# Altium project MUHTAS-1.PrjPcb
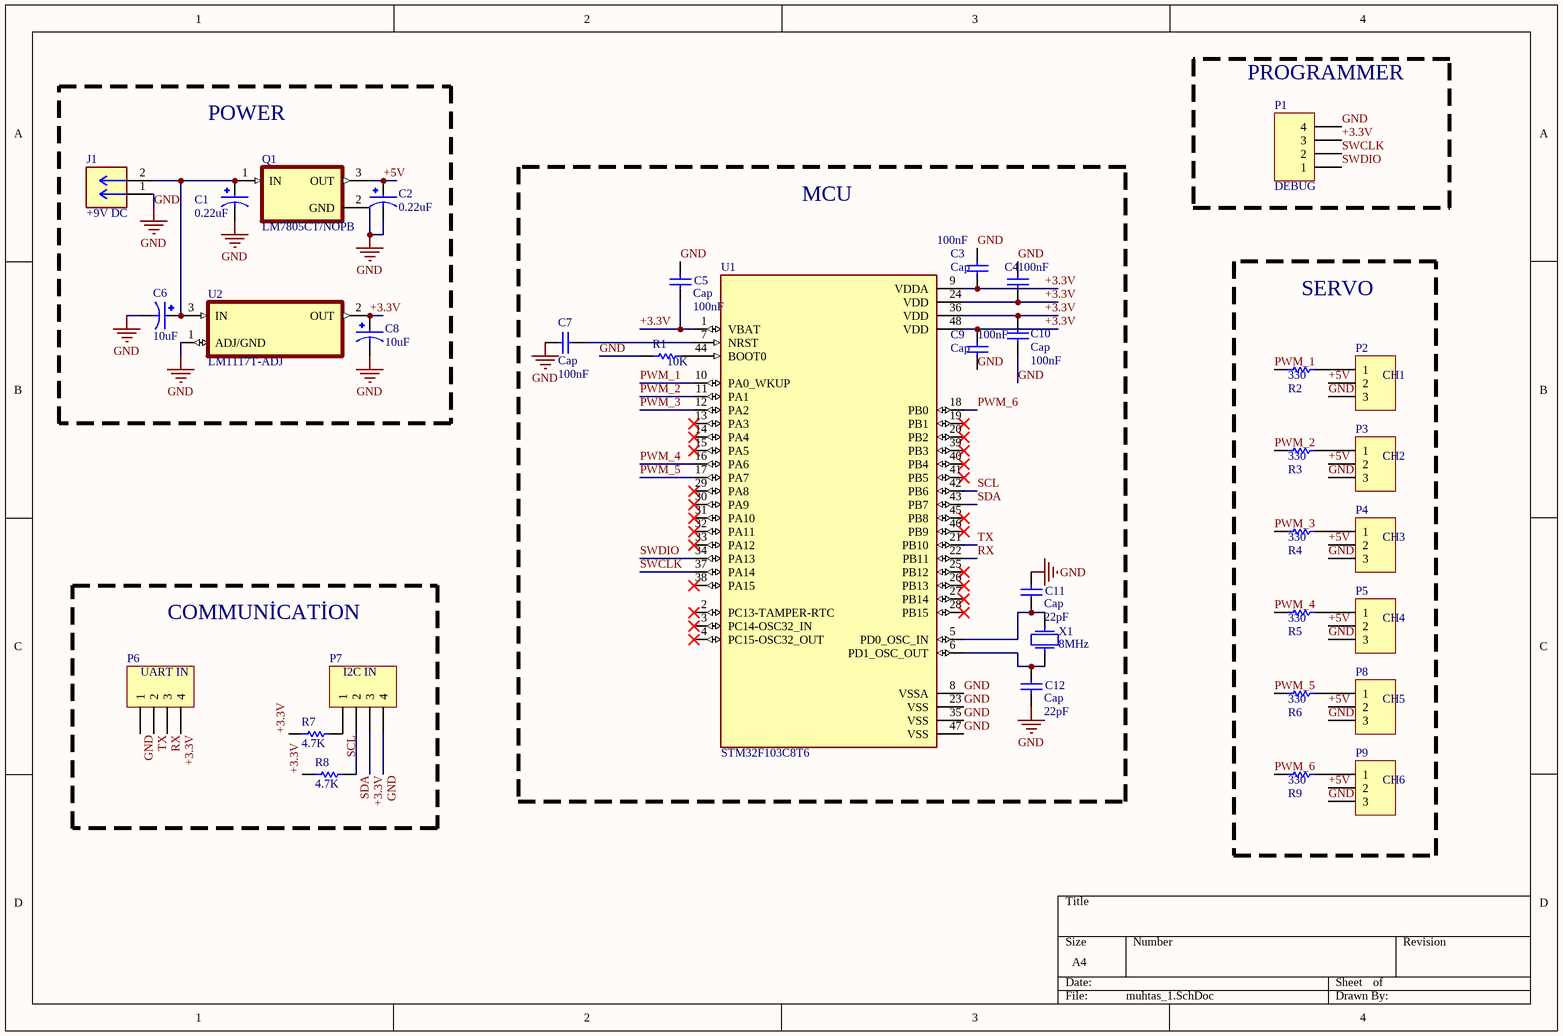
[diagram p0: muhtas_1.SchDoc]
2 sheets, 71 parts. Net scope: global (net labels, ports and power ports of the same name join across sheets).
Board files: MUHTAS-1.PcbDoc, baski.PcbDoc
Sheets:
  muhtas_1.SchDoc
  MUHTAS-1.SchDoc

## Sheet muhtas_1.SchDoc
size A4; SheetNumber: 1; SheetTotal: 1

### Parts
(Parts that share a designator on the sheet are numbered #1, #2 ... from top to bottom, then left to right.)
C1#1  0.22uF  [CAPPRD250W50D630H1120]
C2#1  0.22uF  [CAPPRD250W50D630H1120]
C3#1  Cap  value 100nF  [CAPPRD250W50D630H1120]
C4#1  value 100nF  [CAPPRD250W50D630H1120]
C5#1  Cap  value 100nF  [CAPPRD250W50D630H1120]
C6#1  10uF  [CAPPRD250W50D630H1120]
C7#1  Cap  value 100nF  [CAPPRD250W50D630H1120]
C8#1  10uF  [CAPPRD250W50D630H1120]
C9#1  Cap  value 100nF  [CAPPRD250W50D630H1120]
C10#1  Cap  value 100nF  [CAPPRD250W50D630H1120]
C11#1  Cap  value 22pF  [CAPPRD250W50D630H1120]
C12#1  Cap  value 22pF  [CAPPRD250W50D630H1120]
J1  +9V DC  [CONN_39773-0002_MOL]
P1#1  DEBUG  [HDR1X4]
P2#1  CH1  [HDR1X3]
P3#1  CH2  [HDR1X3]
P4#1  CH3  [HDR1X3]
P5#1  CH4  [HDR1X3]
P6#1  UART IN  [HDR1X4]
P7#1  I2C IN  [HDR1X4]
P8#1  CH5  [HDR1X3]
P9#1  CH6  [HDR1X3]
Q1  LM7805CT/NOPB  [TO254P1054X470X2600-3]
R1#1  value 10K  [AXIAL-0.3]  (hidden comment: Resistor)
R2#1  value 330  [AXIAL-0.3]  (hidden comment: Resistor)
R3#1  value 330  [AXIAL-0.3]  (hidden comment: Resistor)
R4#1  value 330  [AXIAL-0.3]  (hidden comment: Resistor)
R5#1  value 330  [AXIAL-0.3]  (hidden comment: Resistor)
R6#1  value 330  [AXIAL-0.3]  (hidden comment: Resistor)
R7#1  value 4.7K  [AXIAL-0.3]  (hidden comment: Resistor)
R8#1  value 4.7K  [AXIAL-0.3]  (hidden comment: Resistor)
R9#1  value 330  [AXIAL-0.3]  (hidden comment: Resistor)
U1#1  STM32F103C8T6  [QFP50P900X900X160-48N]
U2#1  LM1117T-ADJ  [TO254P1054X470X1955-3]
X1  F0: 8MHz  [RAD-0.1]  (hidden comment: Crystal)

### Blocks framed on the sheet
POWER: C1#1 C2#1 C6#1 C8#1 J1 Q1 U2#1
PROGRAMMER: P1#1
MCU: C3#1 C4#1 C5#1 C7#1 C9#1 C10#1 C11#1 C12#1 R1#1 U1#1 X1
SERVO: P2#1 P3#1 P4#1 P5#1 P8#1 P9#1 R2#1 R3#1 R4#1 R5#1 R6#1 R9#1
COMMUNİCATİON: P6#1 P7#1 R7#1 R8#1

### Nets
+5V: C2#1.P P2#1.2 P3#1.2 P4#1.2 P5#1.2 P8#1.2 P9#1.2 Q1.3(OUT)
GND: C1#1.N C2#1.N C3#1.1 C4#1.1 C5#1.2 C6#1.N C7#1.2 C8#1.N C9#1.2 C10#1.2 C11#1.2 C12#1.1 J1.1 P1#1.4 P2#1.3 P3#1.3 P4#1.3 P5#1.3 P6#1.1 P7#1.4 P8#1.3 P9#1.3 Q1.2(GND) R1#1.1 U1#1.8(VSSA) U1#1.23(VSS) U1#1.35(VSS) U1#1.47(VSS) U2#1.1(ADJ/GND)
+3.3V: C3#1.2 C4#1.2 C5#1.1 C8#1.P C9#1.1 C10#1.1 P1#1.3 P6#1.4 P7#1.3 R7#1.2 R8#1.2 U1#1.1(VBAT) U1#1.9(VDDA) U1#1.24(VDD) U1#1.36(VDD) U1#1.48(VDD) U2#1.2(OUT)
PWM_1: R2#1.1 U1#1.10(PA0_WKUP)
PWM_2: R3#1.1 U1#1.11(PA1)
PWM_3: R4#1.1 U1#1.12(PA2)
PWM_4: R5#1.1 U1#1.16(PA6)
PWM_5: R6#1.1 U1#1.17(PA7)
PWM_6: R9#1.1 U1#1.18(PB0)
RX: P6#1.3 U1#1.22(PB11)
SCL: P7#1.1 R7#1.1 U1#1.42(PB6)
SDA: P7#1.2 R8#1.1 U1#1.43(PB7)
SWCLK: P1#1.2 U1#1.37(PA14)
SWDIO: P1#1.1 U1#1.34(PA13)
TX: P6#1.2 U1#1.21(PB10)
NetC1#1_P: C1#1.P C6#1.P J1.2 Q1.1(IN) U2#1.3(IN)
NetC7#1_1: C7#1.1 U1#1.7(NRST)
NetC11#1_1: C11#1.1 U1#1.5(PD0_OSC_IN) X1.2
NetC12#1_2: C12#1.2 U1#1.6(PD1_OSC_OUT) X1.1
NetP2#1_1: P2#1.1 R2#1.2
NetP3#1_1: P3#1.1 R3#1.2
NetP4#1_1: P4#1.1 R4#1.2
NetP5#1_1: P5#1.1 R5#1.2
NetP8#1_1: P8#1.1 R6#1.2
NetP9#1_1: P9#1.1 R9#1.2
NetR1#1_2: R1#1.2 U1#1.44(BOOT0)

Not connected (* = marked no-connect by the designer): U1#1 2(PC13-TAMPER-RTC)* 3(PC14-OSC32_IN)* 4(PC15-OSC32_OUT)* 13(PA3)* 14(PA4)* 15(PA5)* 19(PB1)* 20(PB2)* 25(PB12)* 26(PB13)* 27(PB14)* 28(PB15)* 29(PA8)* 30(PA9)* 31(PA10)* 32(PA11)* 33(PA12)* 38(PA15)* 39(PB3)* 40(PB4)* 41(PB5)* 45(PB8)* 46(PB9)*

### Library data of the parts
C1#1 C2#1 C6#1 C8#1 = ECEA1HN100UI: CAP ALUM 10UF 20% 50V RADIAL; MP: ECE-A1HN100UI; MF: Panasonic; SnapEDA_Link: https://www.snapeda.com/parts/ECE-A1HN100UI/Panasonic/view-part/2321690/?ref=snap; Price: None; Check_prices: https://www.snapeda.com/parts/ECE-A1HN100UI/Panasonic/view-part/2321690/?ref=eda; Value: *; Availability: In Stock; Package: RADIAL-2 Panasonic
C3#1 C4#1 C5#1 C7#1 C9#1 C10#1 C11#1 C12#1 = Cap: Capacitor; pin to pad: 1>P 2>N; Published: 8-Jun-2000; LatestRevisionDate: 17-Jul-2002; LatestRevisionNote: Re-released for DXP Platform.; PackageReference: RAD-0.3; Publisher: Altium Limited; PackageDescription: Radial Cap, Thru-Hole; 2 Leads; 0.3 in Pin Spacing
J1 = 397730002: 2 Position Wire to Board Terminal Block Horizontal with Board 0.100 (2.54mm) Through Hole; MF: Molex; SnapEDA_Link: https://www.snapeda.com/parts/397730002/Molex/view-part/?ref=snap; Package: None; Value: *; MP: 397730002; Check_prices: https://www.snapeda.com/parts/397730002/Molex/view-part/?ref=eda
P1#1 P6#1 P7#1 = Header 4: Header, 4-Pin; LatestRevisionDate: 17-Jul-2002; LatestRevisionNote: Re-released for DXP Platform.; Publisher: Altium Limited
P2#1 P3#1 P4#1 P5#1 P8#1 P9#1 = Header 3: Header, 3-Pin; LatestRevisionDate: 17-Jul-2002; LatestRevisionNote: Re-released for DXP Platform.; Publisher: Altium Limited
Q1 = LM7805CT/NOPB: Linear Voltage Regulator IC Positive Fixed 1 Output 1.5A TO-220-3; MF: ON Semiconductor; Purchase-URL: https://pricing.snapeda.com/search/part/LM7805CT/?ref=eda; Check_prices: https://www.snapeda.com/parts/LM7805CT/Onsemi/view-part/?ref=eda; SnapEDA_Link: https://www.snapeda.com/parts/LM7805CT/Onsemi/view-part/?ref=snap; Price: None; Availability: In Stock; Package: TO-220-3 ON Semiconductor; MP: LM7805CT; Value: *
R1#1 R2#1 R3#1 R4#1 R5#1 R6#1 R7#1 R8#1 R9#1 = Resistor: TC1: 0; SimulationGenericComponent: True; TC2: 0
U1#1 = STM32F103C8T6: ARM® Cortex®-M3 STM32F1 Microcontroller IC 32-Bit 72MHz 64KB (64K x 8) FLASH 48-LQFP (7x7); MF: STMicroelectronics; SnapEDA_Link: https://www.snapeda.com/parts/STM32F103C8T6/STMicroelectronics/view-part/?ref=snap; Package: LQFP-48 STMicroelectronics; Value: *; MP: STM32F103C8T6; Check_prices: https://www.snapeda.com/parts/STM32F103C8T6/STMicroelectronics/view-part/?ref=eda
U2#1 = LM1117T-ADJ: 800-mA 15-V linear voltage regulator; MF: Texas Instruments; MP: LM1117T-ADJ/NOPB; SnapEDA_Link: https://www.snapeda.com/parts/LM1117T-ADJ/NOPB/Texas+Instruments/view-part/?ref=snap; Package: TO-220-3 Texas Instruments; Value: *; Check_prices: https://www.snapeda.com/parts/LM1117T-ADJ/NOPB/Texas+Instruments/view-part/?ref=eda
X1 = Crystal: R: 500; Q: 50K; SimulationGenericComponent: True

## Sheet MUHTAS-1.SchDoc
size A4; SheetNumber: 1; SheetTotal: 1; websayfasi: web sitesi?; aciklama: aciklama ?; olcu: A4; cizim_no: cizim_no giriniz?; Kontrol: Kontrol ?; versiyon: V?; SPICEModelCacheAYKAHSNS: <root> / <DocumentId>AYKAHSNS</DocumentId> / <CacheFrame Number="0"> / <Model Name="xtal" Kind="CKT"> / <Text>*Generic type:crystal pkg:HC33/51 / .SUBCKT XTAL 1 2 PARAMS: FREQ=1Meg RS=750 C=13pf Q=1000 / LX 1 3 {((Q*RS)/(6.2831852*FREQ))} IC=0.5M / CX 3 4 {(1/(Q*6.2831852*FREQ*RS))} / C0 1 2 {C} / RS 4 2 {RS} / .ENDS XTAL</Text> / </Model> / </CacheFrame> / </root>
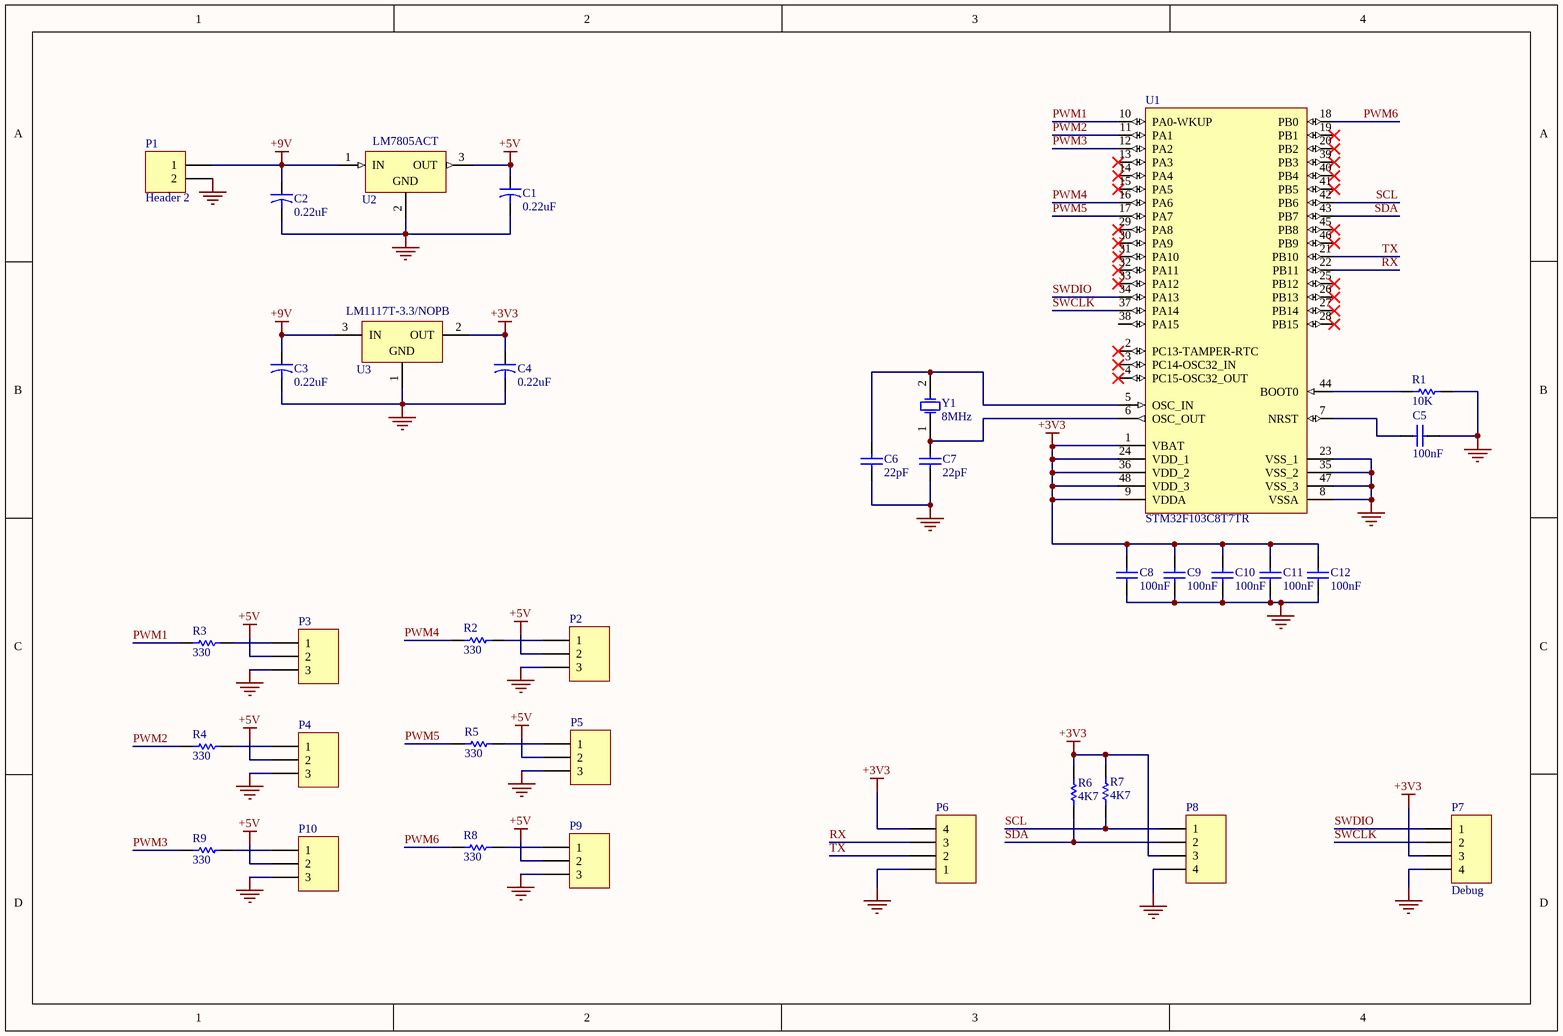
[diagram p1: MUHTAS-1.SchDoc]

### Parts
(Parts that share a designator on the sheet are numbered #1, #2 ... from top to bottom, then left to right.)
?  (no value)  (graphical)
C1#2  0.22uF  [cap_pich_5mm_dia_5mm]
C2#2  0.22uF  [cap_pich_5mm_dia_5mm]
C3#2  0.22uF  [cap_pich_5mm_dia_5mm]
C4#2  0.22uF  [cap_pich_5mm_dia_5mm]
C5#2  100nF  [1206]
C6#2  22pF  [mercimek]
C7#2  22pF  [mercimek]
C8#2  100nF  [1206]
C9#2  100nF  [1206]
C10#2  100nF  [1206]
C11#2  100nF  [1206]
C12#2  100nF  [1206]
P1#2  Header 2  [5mm_Klemens]
P2#2  Header 3  [header_1x3]  (value not drawn)
P3#2  Header 3  [header_1x3]  (value not drawn)
P4#2  Header 3  [header_1x3]  (value not drawn)
P5#2  Header 3  [header_1x3]  (value not drawn)
P6#2  Header 4  [HEADER_1X4]  (value not drawn)
P7#2  Debug  [HEADER_1X4]
P8#2  Header 4  [HEADER_1X4]  (value not drawn)
P9#2  Header 3  [header_1x3]  (value not drawn)
P10  Header 3  [header_1x3]  (value not drawn)
R1#2  10K  [direnc_axial_0.4]
R2#2  330  [direnc_axial_0.4]
R3#2  330  [direnc_axial_0.4]
R4#2  330  [direnc_axial_0.4]
R5#2  330  [direnc_axial_0.4]
R6#2  4K7  [direnc_axial_0.4]
R7#2  4K7  [direnc_axial_0.4]
R8#2  330  [direnc_axial_0.4]
R9#2  330  [direnc_axial_0.4]
U1#2  STM32F103C8T7TR  [STM-LQFP48_M]
U2#2  LM7805ACT  [FAIR-TO-220-3]
U3  LM1117T-3.3/NOPB  [NDE0003A]
Y1  8MHz  [xtal]

### Nets
+3V3: C4#2.1 C8#2.1 C9#2.1 C10#2.1 C11#2.1 C12#2.1 P6#2.4 P7#2.3 P8#2.3 R6#2.1 R7#2.2 U1#2.1(VBAT) U1#2.9(VDDA) U1#2.24(VDD_1) U1#2.36(VDD_2) U1#2.48(VDD_3) U3.2(OUT)
+5V: C1#2.1 P2#2.2 P3#2.2 P4#2.2 P5#2.2 P9#2.2 P10.2 U2#2.3(OUT)
+9V: C2#2.1 C3#2.1 P1#2.1 U2#2.1(IN) U3.3(IN)
GND: C1#2.2 C2#2.2 C3#2.2 C4#2.2 C5#2.2 C6#2.2 C7#2.2 C8#2.2 C9#2.2 C10#2.2 C11#2.2 C12#2.2 P1#2.2 P2#2.3 P3#2.3 P4#2.3 P5#2.3 P6#2.1 P7#2.4 P8#2.4 P9#2.3 P10.3 R1#2.1 U1#2.8(VSSA) U1#2.23(VSS_1) U1#2.35(VSS_2) U1#2.47(VSS_3) U2#2.2(GND) U3.1(GND)
PWM1: R3#2.1 U1#2.10(PA0-WKUP)
PWM2: R4#2.1 U1#2.11(PA1)
PWM3: R9#2.1 U1#2.12(PA2)
PWM4: R2#2.1 U1#2.16(PA6)
PWM5: R5#2.1 U1#2.17(PA7)
PWM6: R8#2.1 U1#2.18(PB0)
RX: P6#2.3 U1#2.22(PB11)
SCL: P8#2.1 R7#2.1 U1#2.42(PB6)
SDA: P8#2.2 R6#2.2 U1#2.43(PB7)
SWCLK: P7#2.2 U1#2.37(PA14)
SWDIO: P7#2.1 U1#2.34(PA13)
TX: P6#2.2 U1#2.21(PB10)
NetC5#2_1: C5#2.1 U1#2.7(NRST)
NetC6#2_1: C6#2.1 U1#2.5(OSC_IN) Y1.2(OSC2)
NetC7#2_1: C7#2.1 U1#2.6(OSC_OUT) Y1.1(OSC1)
NetP2#2_1: P2#2.1 R2#2.2
NetP3#2_1: P3#2.1 R3#2.2
NetP4#2_1: P4#2.1 R4#2.2
NetP5#2_1: P5#2.1 R5#2.2
NetP9#2_1: P9#2.1 R8#2.2
NetP10_1: P10.1 R9#2.2
NetR1#2_2: R1#2.2 U1#2.44(BOOT0)

Not connected (* = marked no-connect by the designer): U1#2 2(PC13-TAMPER-RTC)* 3(PC14-OSC32_IN)* 4(PC15-OSC32_OUT)* 13(PA3)* 14(PA4)* 15(PA5)* 19(PB1)* 20(PB2)* 25(PB12)* 26(PB13)* 27(PB14)* 28(PB15)* 29(PA8)* 30(PA9)* 31(PA10)* 32(PA11)* 33(PA12)* 38(PA15) 39(PB3)* 40(PB4)* 41(PB5)* 45(PB8)* 46(PB9)*

### Notes on the sheet
- Ölçü:
- Sayfa Adı:
- Proje Adı:
- Cizim No:
- Revizyon:
- Kontrol Eden:
- Tarih:
- Sayfa:
- -

### Library data of the parts
? = Antet: Standart Antet
C1#2 C2#2 C3#2 C4#2 = Cap2: Capacitor; Published: 23-Sep-2002; PackageReference: CAPR5-4X5; Publisher: Altium Limited; PackageDescription: Capacitor; 2 Leads; Value: 0.22uF
C5#2 C6#2 C7#2 C8#2 C9#2 C10#2 C11#2 C12#2 = Cap: Capacitor; Published: 8-Jun-2000; LatestRevisionDate: 17-Jul-2002; LatestRevisionNote: Re-released for DXP Platform.; PackageReference: RAD-0.3; Publisher: Altium Limited; PackageDescription: Radial Cap, Thru-Hole; 2 Leads; 0.3 in Pin Spacing
  C5#2 C8#2 C9#2 C10#2 C11#2 C12#2: Value: 100nF
  C6#2 C7#2: Value: 22pF
P1#2 = Header 2: Header, 2-Pin; LatestRevisionDate: 17-Jul-2002; LatestRevisionNote: Re-released for DXP Platform.; Publisher: Altium Limited
P2#2 P3#2 P4#2 P5#2 P9#2 P10 = Header 3: Header, 3-Pin; LatestRevisionDate: 17-Jul-2002; LatestRevisionNote: Re-released for DXP Platform.; Publisher: Altium Limited
P6#2 P7#2 P8#2 = Header 4: Header, 4-Pin; LatestRevisionDate: 17-Jul-2002; LatestRevisionNote: Re-released for DXP Platform.; Publisher: Altium Limited
R1#2 R2#2 R3#2 R4#2 R5#2 R6#2 R7#2 R8#2 R9#2 = Res1: Resistor; Published: 8-Jun-2000; LatestRevisionDate: 17-Jul-2002; LatestRevisionNote: Re-released for DXP Platform.; PackageReference: AXIAL-0.3; Publisher: Altium Limited; PackageDescription: Axial Device, Thru-Hole; 2 Leads; 0.3 in Pin Spacing
  R1#2: Value: 10K
  R2#2 R3#2 R4#2 R5#2 R8#2 R9#2: Value: 330
  R6#2 R7#2: Value: 4K7
U1#2 = CMP-0237-00303-2: ARM Cortex-M3 32-bit MCU, 64 KB Flash, 20 KB Internal RAM, 37 I/Os, 48-Pin LQFP, -40 to 105 degC, Tape and Reel; Manufacturer: STMicroelectronics; Operating Frequency(F) (Processor speed) (MHz): 72; Supply Voltage(Vcc) min (V): 2; FLASH Size (Prog) (kB): 64; Internal RAM Size (kB): 20; I/Os (High Current): 36; Package Reference: LQFP48; ComponentLink2Description: Datasheet; ComponentLink2URL: http://www.st.com/st-web-ui/static/active/en/resource/technical/document/datasheet/CD00161566.pdf; ComponentLink1URL: http://www.st.com/; Packing: Tape and Reel; ComponentLink1Description: Manufacturer URL; DatasheetVersion: Rev. 17; Core: ARM Cortex-M3; Mounting Technology: Surface Mount; PartNumber: STM32F103C8T7TR; Package Description: 48-Pin Low Profile Quad Flat Package, Body 7 x 7 mm, Pitch 0.5 mm
U2#2 = CMP-2000-04937-1: Positive Voltage Regulator, 5 V, 1 A, 0 to 125 degC, 3-Pin TO-220, RoHS, Tube; Manufacturer: Fairchild; Number of Outputs: 1; Typical Dropout Voltage @ Current: 2V@1A; Output Type: Fixed; Output Voltage: 5V; Quiescent Current: 6mA; Dropout Voltage Measurement Current: 1A; Line Regulation: 50mV; Maximum Input Voltage: 35V; Regulator Function: Linear; Load Regulation: 100mV; Package Type: TO-220; Mounting Type: ThroughHole; Height: 16.51mm; Maximum Operating Temperature: +125degC; Datasheet Version: Rev. 1.0.1, 05/2006; Package Reference: TO-220; Minimum Operating Temperature: 0degC; Manufacturer URL: https://www.fairchildsemi.com/; Package URL: https://www.fairchildsemi.com/package-drawings/TO/TO220B03.pdf; Length: 10.67mm; Series: LM78xx; Dimensions: 10.67x4.83x16.51mm; Polarity: Positive; Maximum Output Current: 1A; Pin Count: 3; Width: 4.83mm; Package Description: 3-Pin Through Hole Device, Body 10 x 4.5 mm, Pitch 2.54 mm; Datasheet URL: https://datasheet.ciiva.com/5816/1359194-5816420.pdf
U3 = CMP-0062-02494-3: 800mA Low-Dropout Linear Regulator, 3-pin TO-220, Pb-Free; Manufacturer: Texas Instruments; PackageTopMarking: NSUZXYTTE#*LM1117T*3.3; PowerWise: N; CompType: LDO IC; RoHS: Y; ComponentLink1URL: http://www.ti.com/general/docs/lit/getliterature.tsp?genericPartNumber=LM1117-N&fileType=pdf; PackageReference: NDE0003A; PinCount: 3; ComponentLink1Description: Datasheet URL; PackageDescription: TO-220, Molded, 3 Lead, Straight
Y1 = XTAL: Crystal Oscillator; Published: 8-Jun-2000; LatestRevisionDate: 17-Jul-2002; LatestRevisionNote: Re-released for DXP Platform.; PackageReference: R38; Publisher: Altium Limited; PackageDescription: Crystal, Thru-Hole; 2 Leads; Body 3.1 x 8.2 mm (Dia.xH)

## Nets that join several sheets
+5V: muhtas_1 (8 pins), MUHTAS-1 (8 pins)
GND: muhtas_1 (29 pins), MUHTAS-1 (29 pins)
RX: muhtas_1 (P6#1.3 U1#1.22), MUHTAS-1 (P6#2.3 U1#2.22)
SCL: muhtas_1 (P7#1.1 R7#1.1 U1#1.42), MUHTAS-1 (P8#2.1 R7#2.1 U1#2.42)
SDA: muhtas_1 (P7#1.2 R8#1.1 U1#1.43), MUHTAS-1 (P8#2.2 R6#2.2 U1#2.43)
SWCLK: muhtas_1 (P1#1.2 U1#1.37), MUHTAS-1 (P7#2.2 U1#2.37)
SWDIO: muhtas_1 (P1#1.1 U1#1.34), MUHTAS-1 (P7#2.1 U1#2.34)
TX: muhtas_1 (P6#1.2 U1#1.21), MUHTAS-1 (P6#2.2 U1#2.21)